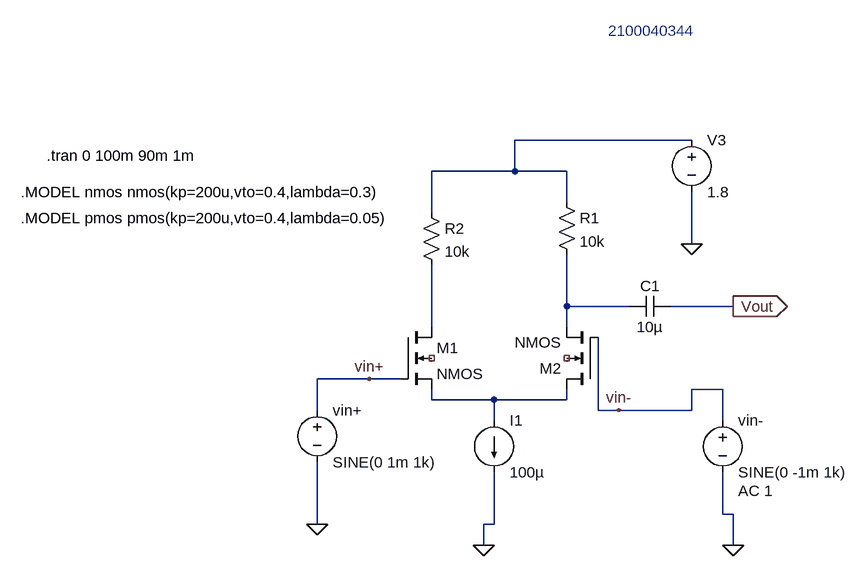
[diagram p0: schematic Differential Amplifier Circuit using NMOS transistors..asc]
Differential Amplifier Circuit using NMOS transistors..asc, the LTspice schematic file:
Version 4
SHEET 1 880 680
WIRE 512 -128 240 -128
WIRE 240 -80 240 -128
WIRE 240 -80 112 -80
WIRE 320 -80 240 -80
WIRE 320 -32 320 -80
WIRE 112 -16 112 -80
WIRE 512 32 512 -48
WIRE 320 128 320 48
WIRE 416 128 320 128
WIRE 576 128 480 128
WIRE 112 160 112 64
WIRE 320 160 320 128
WIRE 16 240 -64 240
WIRE 64 240 16 240
WIRE 560 256 512 256
WIRE 112 272 112 256
WIRE 208 272 112 272
WIRE 320 272 320 256
WIRE 320 272 208 272
WIRE -64 288 -64 240
WIRE 368 288 368 176
WIRE 400 288 368 288
WIRE 512 288 512 256
WIRE 512 288 400 288
WIRE 208 304 208 272
WIRE 560 304 560 256
WIRE 560 448 560 384
WIRE 576 448 560 448
WIRE -64 464 -64 368
WIRE 208 464 208 384
WIRE 208 464 192 464
WIRE 192 496 192 464
WIRE 576 496 576 448
FLAG -64 464 0
FLAG 576 496 0
FLAG 192 496 0
FLAG 512 32 0
FLAG 576 128 Vout
IOPIN 576 128 Out
FLAG 16 240 vin+
FLAG 400 288 vin-
SYMBOL nmos4 64 160 R0
SYMATTR InstName M1
SYMBOL res 304 -48 R0
SYMATTR InstName R1
SYMATTR Value 10k
SYMBOL res 96 -32 R0
SYMATTR InstName R2
SYMATTR Value 10k
SYMBOL voltage -64 272 R0
WINDOW 123 0 0 Left 0
WINDOW 39 0 0 Left 0
SYMATTR InstName vin+
SYMATTR Value SINE(0 1m 1k)
SYMBOL voltage 560 288 R0
WINDOW 123 24 124 Left 2
WINDOW 39 0 0 Left 0
SYMATTR Value2 AC 1
SYMATTR InstName vin-
SYMATTR Value SINE(0 -1m 1k)
SYMBOL voltage 512 -144 R0
WINDOW 123 0 0 Left 0
WINDOW 39 0 0 Left 0
SYMATTR InstName V3
SYMATTR Value 1.8
SYMBOL cap 480 112 R90
WINDOW 0 0 32 VBottom 2
WINDOW 3 32 32 VTop 2
SYMATTR InstName C1
SYMATTR Value 10µ
SYMBOL current 208 304 R0
WINDOW 123 0 0 Left 0
WINDOW 39 0 0 Left 0
SYMATTR InstName I1
SYMATTR Value 100µ
SYMBOL nmos4 368 256 R180
SYMATTR InstName M2
TEXT -480 -104 Left 2 !.tran 0 100m 90m 1m
TEXT -520 -48 Left 2 !.MODEL nmos nmos(kp=200u,vto=0.4,lambda=0.3)
TEXT -520 -8 Left 2 !.MODEL pmos pmos(kp=200u,vto=0.4,lambda=0.05)
TEXT 384 -296 Left 2 ;2100040344

The netlist it stands for:
* Differential Amplifier Circuit using NMOS transistors..asc
M1 N003 vin+ N004 NC_01 NMOS
R1 N001 N002 10k
R2 N001 N003 10k
vin+ vin+ 0 SINE(0 1m 1k)
vin- vin- 0 SINE(0 -1m 1k) AC 1
V3 N001 0 1.8
C1 Vout N002 10µ
I1 N004 0 100µ
M2 N004 vin- N002 NC_02 NMOS
.model NMOS NMOS
.model PMOS PMOS
.lib standard.mos
.tran 0 100m 90m 1m
.MODEL nmos nmos(kp=200u,vto=0.4,lambda=0.3)
.MODEL pmos pmos(kp=200u,vto=0.4,lambda=0.05)
* 2100040344
.backanno
.end